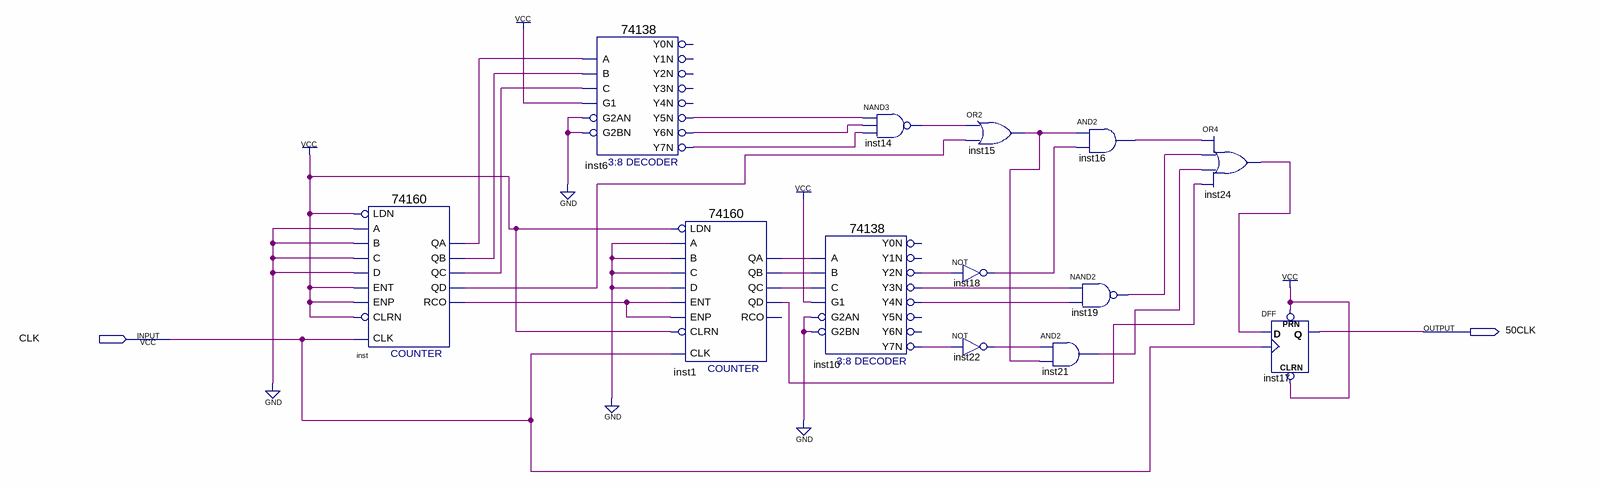
[diagram p0: schematic sheet]
// Quartus schematic Block9.bdf as structural Verilog: 13 symbols, 2 pins
module Block9 (
  input  CLK,
  output \50CLK 
);

  wire inst1_qa, inst1_qb, inst1_qc, inst1_qd, inst6_y5n, inst6_y6n, inst6_y7n, inst10_y2n, inst10_y3n,
       inst10_y4n, inst10_y7n, inst14_out, inst15_out, inst16_out, inst18_out, inst19_out, inst21_out,
       inst22_out, inst24_out, inst_qa, inst_qb, inst_qc, inst_qd, inst_rco;

  \74160  inst (
    .CLK(CLK), .ENT(1'b1), .A(1'b0), .B(1'b0), .C(1'b0), .D(1'b0), .LDN(1'b1), .ENP(1'b1), .CLRN(1'b1),
    .QD(inst_qd), .QA(inst_qa), .QB(inst_qb), .QC(inst_qc), .RCO(inst_rco));
  \74138  inst6 (
    .A(inst_qa), .B(inst_qb), .G1(1'b1), .C(inst_qc), .G2AN(1'b0), .G2BN(1'b0), .Y5N(inst6_y5n),
    .Y6N(inst6_y6n), .Y7N(inst6_y7n));  // open: Y0N, Y1N, Y2N, Y3N, Y4N
  \74160  inst1 (
    .CLK(CLK), .ENT(inst_rco), .A(1'b0), .B(1'b0), .C(1'b0), .D(1'b0), .LDN(1'b1), .ENP(inst_rco),
    .CLRN(1'b1), .QD(inst1_qd), .QA(inst1_qa), .QB(inst1_qb), .QC(inst1_qc));  // open: RCO
  \74138  inst10 (
    .A(inst1_qa), .B(inst1_qb), .G1(1'b1), .C(inst1_qc), .G2AN(1'b0), .G2BN(1'b0), .Y2N(inst10_y2n),
    .Y3N(inst10_y3n), .Y4N(inst10_y4n), .Y7N(inst10_y7n));  // open: Y0N, Y1N, Y5N, Y6N
  nand inst14 (inst14_out, inst6_y5n, inst6_y6n, inst6_y7n);
  not inst18 (inst18_out, inst10_y2n);
  not inst22 (inst22_out, inst10_y7n);
  or inst15 (inst15_out, inst14_out, inst_qd);
  nand inst19 (inst19_out, inst10_y3n, inst10_y4n);
  and inst21 (inst21_out, inst22_out, inst15_out);
  and inst16 (inst16_out, inst15_out, inst18_out);
  or inst24 (inst24_out, inst16_out, inst19_out, inst21_out, inst1_qd);
  DFF inst17 (.CLRN(1'b1), .CLK(CLK), .D(inst24_out), .PRN(1'b1), .Q(\50CLK ));
endmodule
